# EAGLE design Mainland_revB (EAGLE 9.2.0)
CNAME: plus12BLE; CREVISION: RevB; DESIGNER: Josh DeWitt

## Sheet 1 of 2
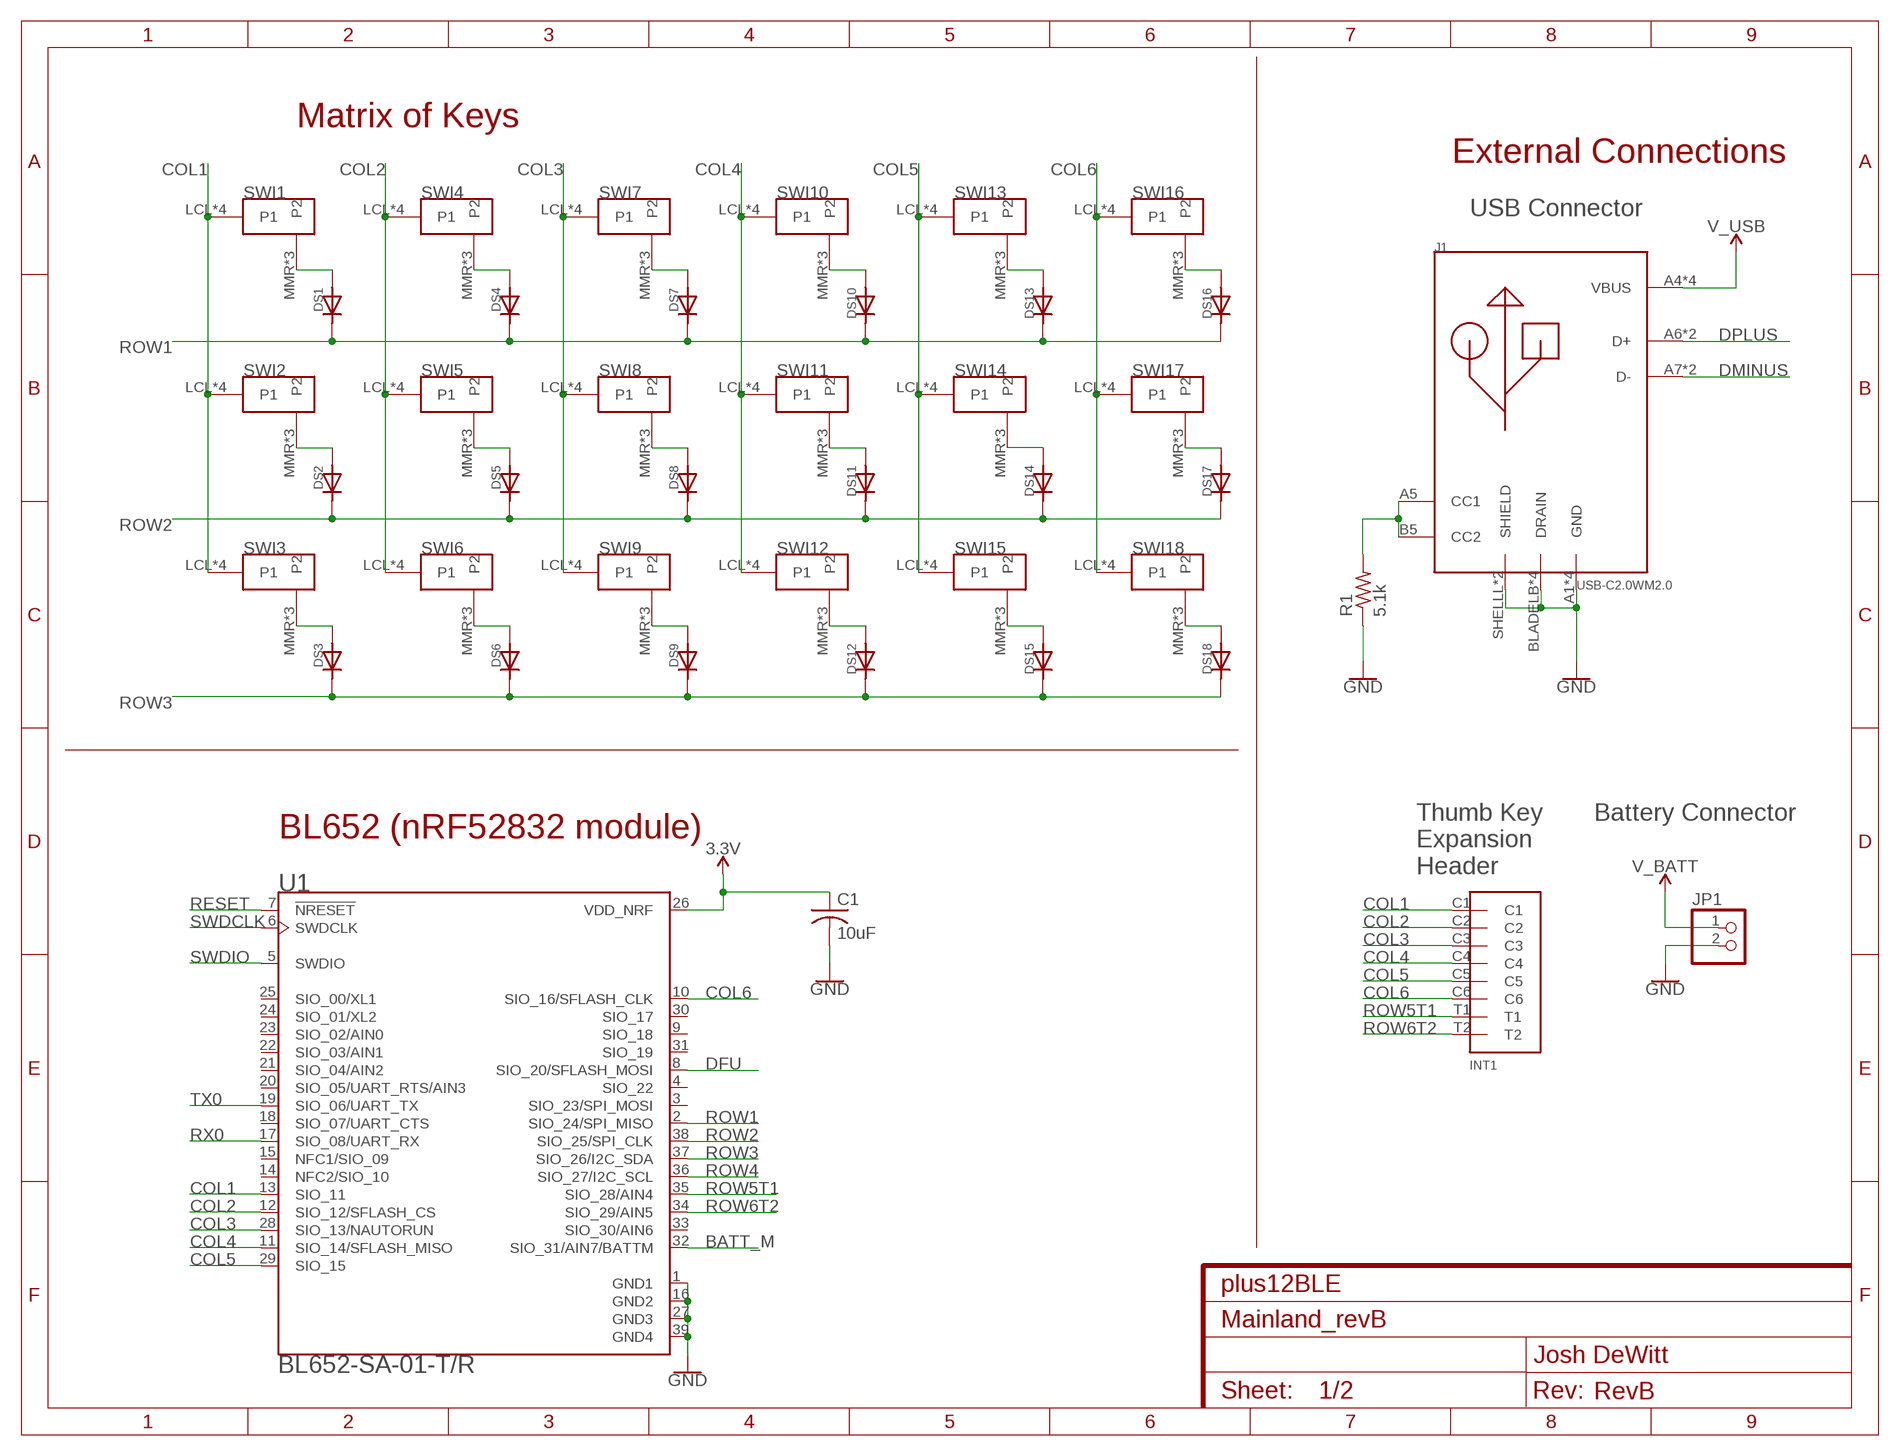
[diagram p0: schematic, sheet 1]

### Parts
C1  10uF  C-USC0805K  [C0805K]
DS1  DIODECOMBO  [DIODE_COMBO]
DS2  DIODECOMBO  [DIODE_COMBO]
DS3  DIODECOMBO  [DIODE_COMBO]
DS4  DIODECOMBO  [DIODE_COMBO]
DS5  DIODECOMBO  [DIODE_COMBO]
DS6  DIODECOMBO  [DIODE_COMBO]
DS7  DIODECOMBO  [DIODE_COMBO]
DS8  DIODECOMBO  [DIODE_COMBO]
DS9  DIODECOMBO  [DIODE_COMBO]
DS10  DIODECOMBO  [DIODE_COMBO]
DS11  DIODECOMBO  [DIODE_COMBO]
DS12  DIODECOMBO  [DIODE_COMBO]
DS13  DIODECOMBO  [DIODE_COMBO]
DS14  DIODECOMBO  [DIODE_COMBO]
DS15  DIODECOMBO  [DIODE_COMBO]
DS16  DIODECOMBO  [DIODE_COMBO]
DS17  DIODECOMBO  [DIODE_COMBO]
DS18  DIODECOMBO  [DIODE_COMBO]
FRAME1  FRAME_LTR_CU_MARK  [FR-LTR-ON-PCB]
INT1  INTRCNNT4X2  [INTRRIBBON]
J1  USB-C2.0WM2.0  [WM17904_SIMP]
JP1  PINHD-1X2  [1X02]
R1  5.1k  R-US_R0603  [R0603]
SWI1  MX/ALPSDOUBLE_SLOT  [DOUBLED_SLOTS]
SWI2  MX/ALPSDOUBLE_SLOT  [DOUBLED_SLOTS]
SWI3  MX/ALPSDOUBLE_SLOT  [DOUBLED_SLOTS]
SWI4  MX/ALPSDOUBLE_SLOT  [DOUBLED_SLOTS]
SWI5  MX/ALPSDOUBLE_SLOT  [DOUBLED_SLOTS]
SWI6  MX/ALPSDOUBLE_SLOT  [DOUBLED_SLOTS]
SWI7  MX/ALPSDOUBLE_SLOT  [DOUBLED_SLOTS]
SWI8  MX/ALPSDOUBLE_SLOT  [DOUBLED_SLOTS]
SWI9  MX/ALPSDOUBLE_SLOT  [DOUBLED_SLOTS]
SWI10  MX/ALPSDOUBLE_SLOT  [DOUBLED_SLOTS]
SWI11  MX/ALPSDOUBLE_SLOT  [DOUBLED_SLOTS]
SWI12  MX/ALPSDOUBLE_SLOT  [DOUBLED_SLOTS]
SWI13  MX/ALPSDOUBLE_SLOT  [DOUBLED_SLOTS]
SWI14  MX/ALPSDOUBLE_SLOT  [DOUBLED_SLOTS]
SWI15  MX/ALPSDOUBLE_SLOT  [DOUBLED_SLOTS]
SWI16  MX/ALPSDOUBLE_SLOT  [DOUBLED_SLOTS]
SWI17  MX/ALPSDOUBLE_SLOT  [DOUBLED_SLOTS]
SWI18  MX/ALPSDOUBLE_SLOT  [DOUBLED_SLOTS]
U1  BL652-SA-01-T/R  [XCVR_BL652-SA-01-T/R]

### Nets
3.3V: C1.1 U1.26(VDD_NRF) ; also sheet 2
BATT_M: U1.32(SIO_31/AIN7/BATTM) ; also sheet 2
COL1: INT1.C1 SWI1.LCL(P1) SWI1.LLP(P1) SWI1.LRLP(P1) SWI1.MML(P1) SWI2.LCL(P1) SWI2.LLP(P1) SWI2.LRLP(P1) SWI2.MML(P1) SWI3.LCL(P1) SWI3.LLP(P1) SWI3.LRLP(P1) SWI3.MML(P1) U1.13(SIO_11)
COL2: INT1.C2 SWI4.LCL(P1) SWI4.LLP(P1) SWI4.LRLP(P1) SWI4.MML(P1) SWI5.LCL(P1) SWI5.LLP(P1) SWI5.LRLP(P1) SWI5.MML(P1) SWI6.LCL(P1) SWI6.LLP(P1) SWI6.LRLP(P1) SWI6.MML(P1) U1.12(SIO_12/SFLASH_CS)
COL3: INT1.C3 SWI7.LCL(P1) SWI7.LLP(P1) SWI7.LRLP(P1) SWI7.MML(P1) SWI8.LCL(P1) SWI8.LLP(P1) SWI8.LRLP(P1) SWI8.MML(P1) SWI9.LCL(P1) SWI9.LLP(P1) SWI9.LRLP(P1) SWI9.MML(P1) U1.28(SIO_13/NAUTORUN)
COL4: INT1.C4 SWI10.LCL(P1) SWI10.LLP(P1) SWI10.LRLP(P1) SWI10.MML(P1) SWI11.LCL(P1) SWI11.LLP(P1) SWI11.LRLP(P1) SWI11.MML(P1) SWI12.LCL(P1) SWI12.LLP(P1) SWI12.LRLP(P1) SWI12.MML(P1) U1.11(SIO_14/SFLASH_MISO)
COL5: INT1.C5 SWI13.LCL(P1) SWI13.LLP(P1) SWI13.LRLP(P1) SWI13.MML(P1) SWI14.LCL(P1) SWI14.LLP(P1) SWI14.LRLP(P1) SWI14.MML(P1) SWI15.LCL(P1) SWI15.LLP(P1) SWI15.LRLP(P1) SWI15.MML(P1) U1.29(SIO_15)
COL6: INT1.C6 SWI16.LCL(P1) SWI16.LLP(P1) SWI16.LRLP(P1) SWI16.MML(P1) SWI17.LCL(P1) SWI17.LLP(P1) SWI17.LRLP(P1) SWI17.MML(P1) SWI18.LCL(P1) SWI18.LLP(P1) SWI18.LRLP(P1) SWI18.MML(P1) U1.10(SIO_16/SFLASH_CLK)
DFU: U1.8(SIO_20/SFLASH_MOSI) ; also sheet 2
DMINUS: J1.A7(D-) J1.B7(D-) ; also sheet 2
DPLUS: J1.A6(D+) J1.B6(D+) ; also sheet 2
GND: C1.2 J1.A1(GND) J1.A12(GND) J1.B1(GND) J1.B12(GND) J1.BLADELB(DRAIN) J1.BLADELF(DRAIN) J1.BLADERB(DRAIN) J1.BLADERF(DRAIN) J1.SHELLL(SHIELD) J1.SHELLR(SHIELD) JP1.2 R1.1 U1.1(GND1) U1.16(GND2) U1.27(GND3) U1.39(GND4) ; also sheet 2
N$1: DS1.ANOST(AN) DS1.ANOT(AN) SWI1.MMR(P2) SWI1.RCL(P2) SWI1.RLMID(P2)
N$2: DS4.ANOST(AN) DS4.ANOT(AN) SWI4.MMR(P2) SWI4.RCL(P2) SWI4.RLMID(P2)
N$3: DS7.ANOST(AN) DS7.ANOT(AN) SWI7.MMR(P2) SWI7.RCL(P2) SWI7.RLMID(P2)
N$4: DS10.ANOST(AN) DS10.ANOT(AN) SWI10.MMR(P2) SWI10.RCL(P2) SWI10.RLMID(P2)
N$5: DS13.ANOST(AN) DS13.ANOT(AN) SWI13.MMR(P2) SWI13.RCL(P2) SWI13.RLMID(P2)
N$6: DS16.ANOST(AN) DS16.ANOT(AN) SWI16.MMR(P2) SWI16.RCL(P2) SWI16.RLMID(P2)
N$7: DS2.ANOST(AN) DS2.ANOT(AN) SWI2.MMR(P2) SWI2.RCL(P2) SWI2.RLMID(P2)
N$8: DS5.ANOST(AN) DS5.ANOT(AN) SWI5.MMR(P2) SWI5.RCL(P2) SWI5.RLMID(P2)
N$9: DS8.ANOST(AN) DS8.ANOT(AN) SWI8.MMR(P2) SWI8.RCL(P2) SWI8.RLMID(P2)
N$10: DS11.ANOST(AN) DS11.ANOT(AN) SWI11.MMR(P2) SWI11.RCL(P2) SWI11.RLMID(P2)
N$11: DS14.ANOST(AN) DS14.ANOT(AN) SWI14.MMR(P2) SWI14.RCL(P2) SWI14.RLMID(P2)
N$12: DS17.ANOST(AN) DS17.ANOT(AN) SWI17.MMR(P2) SWI17.RCL(P2) SWI17.RLMID(P2)
N$13: DS3.ANOST(AN) DS3.ANOT(AN) SWI3.MMR(P2) SWI3.RCL(P2) SWI3.RLMID(P2)
N$14: DS6.ANOST(AN) DS6.ANOT(AN) SWI6.MMR(P2) SWI6.RCL(P2) SWI6.RLMID(P2)
N$15: DS9.ANOST(AN) DS9.ANOT(AN) SWI9.MMR(P2) SWI9.RCL(P2) SWI9.RLMID(P2)
N$16: DS12.ANOST(AN) DS12.ANOT(AN) SWI12.MMR(P2) SWI12.RCL(P2) SWI12.RLMID(P2)
N$17: DS15.ANOST(AN) DS15.ANOT(AN) SWI15.MMR(P2) SWI15.RCL(P2) SWI15.RLMID(P2)
N$18: DS18.ANOST(AN) DS18.ANOT(AN) SWI18.MMR(P2) SWI18.RCL(P2) SWI18.RLMID(P2)
N$20: J1.A5(CC1) J1.B5(CC2) R1.2
RESET: U1.7(!NRESET) ; also sheet 2
ROW1: DS1.CATST(CAT) DS1.CATT(CAT) DS4.CATST(CAT) DS4.CATT(CAT) DS7.CATST(CAT) DS7.CATT(CAT) DS10.CATST(CAT) DS10.CATT(CAT) DS13.CATST(CAT) DS13.CATT(CAT) DS16.CATST(CAT) DS16.CATT(CAT) U1.2(SIO_24/SPI_MISO)
ROW2: DS2.CATST(CAT) DS2.CATT(CAT) DS5.CATST(CAT) DS5.CATT(CAT) DS8.CATST(CAT) DS8.CATT(CAT) DS11.CATST(CAT) DS11.CATT(CAT) DS14.CATST(CAT) DS14.CATT(CAT) DS17.CATST(CAT) DS17.CATT(CAT) U1.38(SIO_25/SPI_CLK)
ROW3: DS3.CATST(CAT) DS3.CATT(CAT) DS6.CATST(CAT) DS6.CATT(CAT) DS9.CATST(CAT) DS9.CATT(CAT) DS12.CATST(CAT) DS12.CATT(CAT) DS15.CATST(CAT) DS15.CATT(CAT) DS18.CATST(CAT) DS18.CATT(CAT) U1.37(SIO_26/I2C_SDA)
ROW4: U1.36(SIO_27/I2C_SCL)
ROW5T1: INT1.T1 U1.35(SIO_28/AIN4)
ROW6T2: INT1.T2 U1.34(SIO_29/AIN5)
RX0: U1.17(SIO_08/UART_RX) ; also sheet 2
SWDCLK: U1.6(SWDCLK) ; also sheet 2
SWDIO: U1.5(SWDIO) ; also sheet 2
TX0: U1.19(SIO_06/UART_TX) ; also sheet 2
V_BATT: JP1.1 ; also sheet 2
V_USB: J1.A4(VBUS) J1.A9(VBUS) J1.B4(VBUS) J1.B9(VBUS) ; also sheet 2
Unconnected: U1.3(SIO_23/SPI_MOSI) U1.4(SIO_22) U1.9(SIO_18) U1.14(NFC2/SIO_10) U1.15(NFC1/SIO_09) U1.18(SIO_07/UART_CTS) U1.20(SIO_05/UART_RTS/AIN3) U1.21(SIO_04/AIN2) U1.22(SIO_03/AIN1) U1.23(SIO_02/AIN0) U1.24(SIO_01/XL2) U1.25(SIO_00/XL1) U1.30(SIO_17) U1.31(SIO_19) U1.33(SIO_30/AIN6)

### Notes on the sheet
- Matrix of Keys
- External Connections
- USB Connector
- Battery Connector
- BL652 (nRF52832 module)
- Thumb Key
  Expansion
  Header

## Sheet 2 of 2
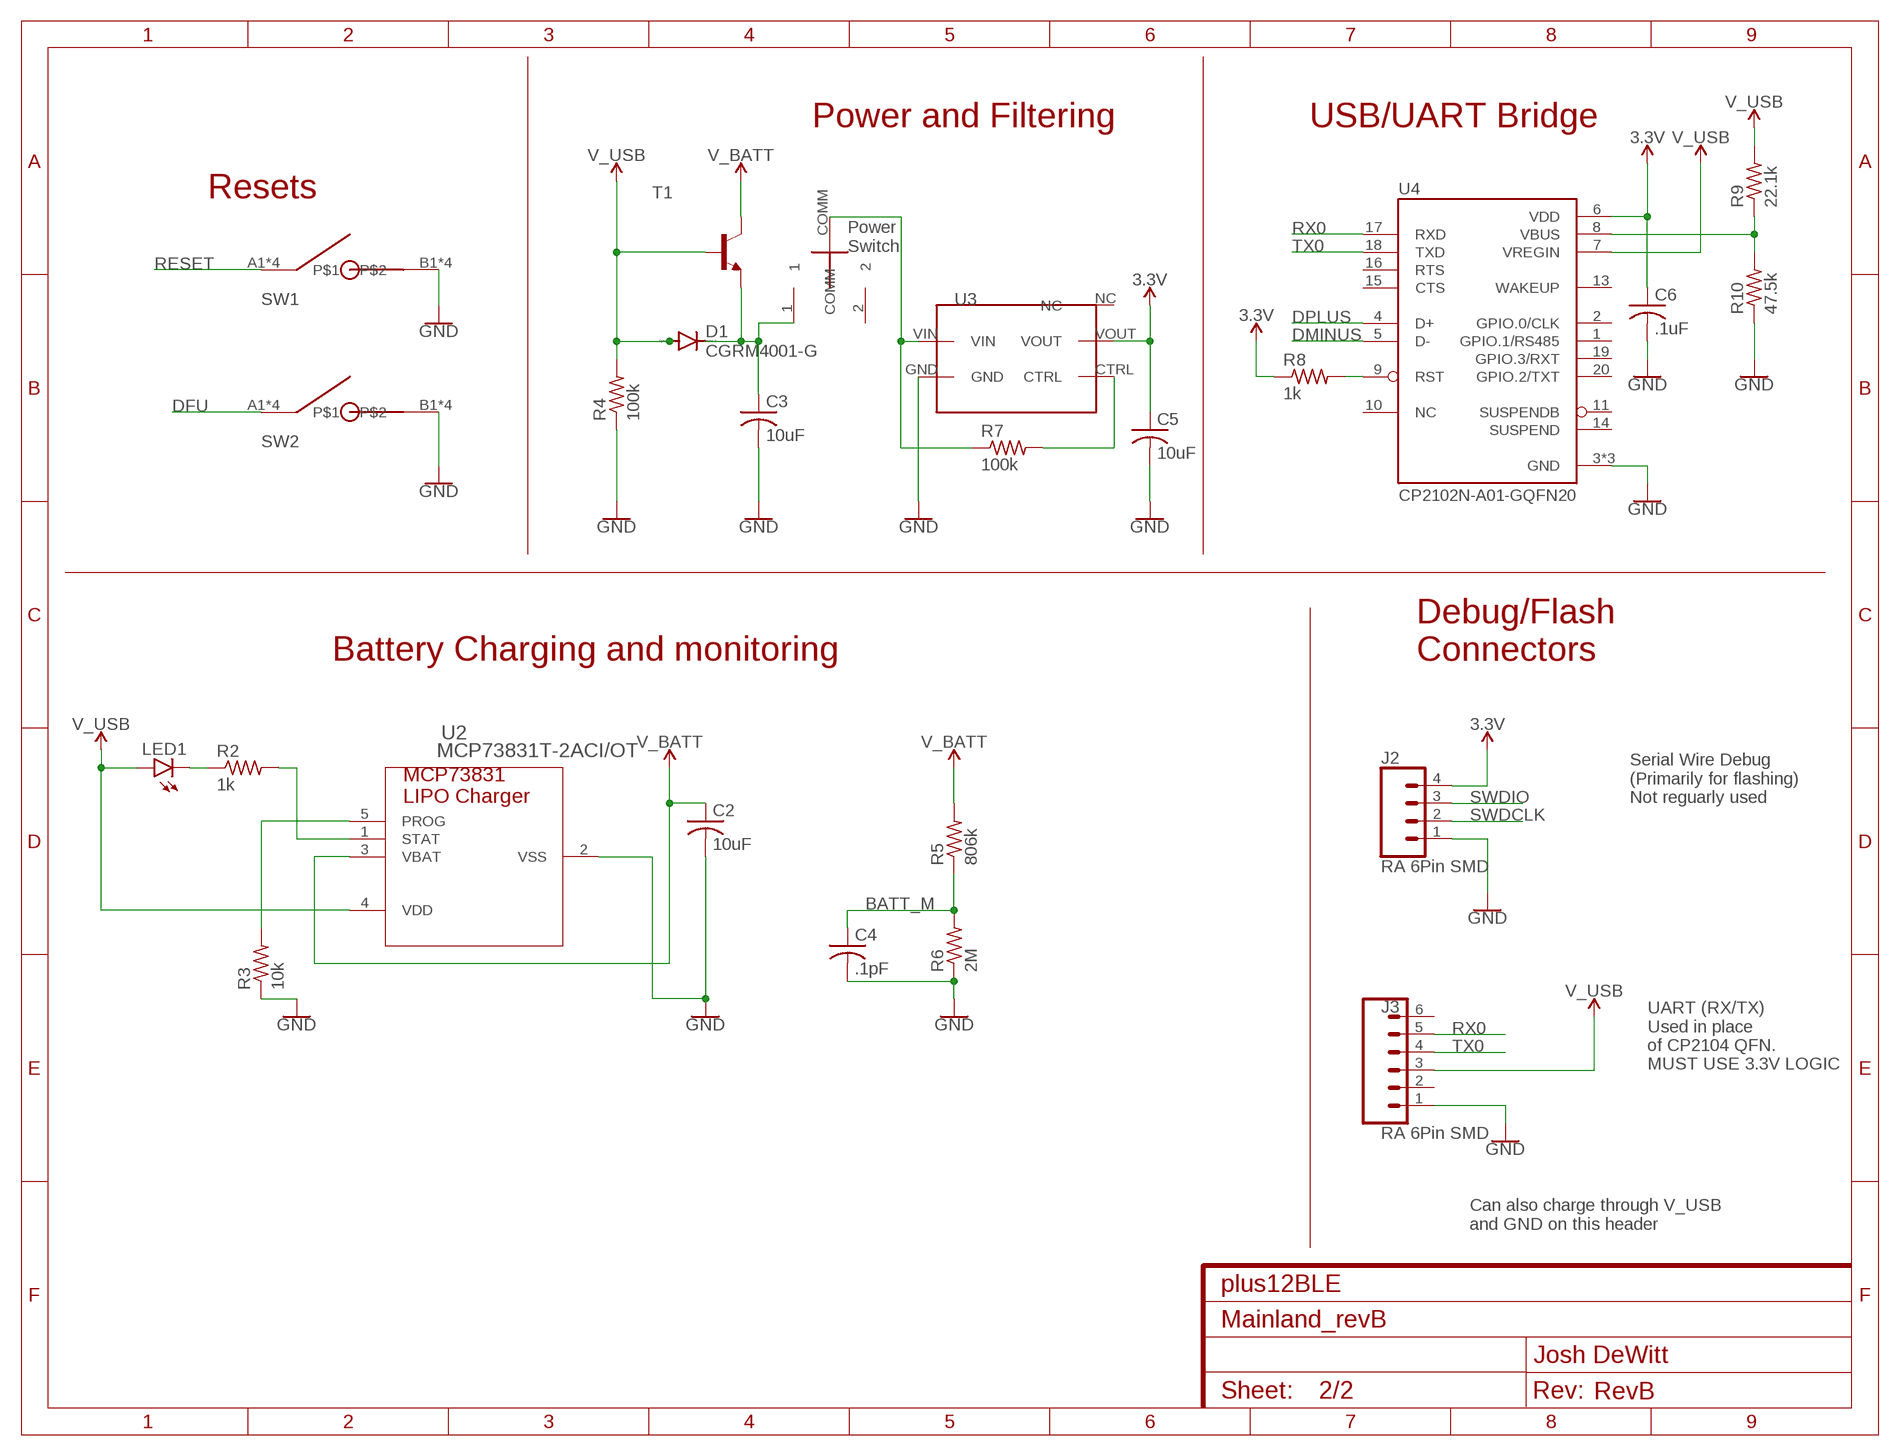
[diagram p1: schematic, sheet 2]

### Parts
C2  10uF  C-USC0805K  [C0805K]
C3  10uF  C-USC0805K  [C0805K]
C4  .1pF  C-USC0603  [C0603]
C5  10uF  C-USC0805K  [C0805K]
C6  .1uF  C-USC0603  [C0603]
D1  CGRM4001-G  [SOD-123_MINI-SMA]
FRAME2  FRAME_LTR_CU_MARK  [FR-LTR-ON-PCB]
J2  RA 6Pin SMD  CONN_04SMD_RA_FEMALE  [1X04_SMD_RA_FEMALE]
J3  RA 6Pin SMD  CONN_06SMD  [1X06-SMD_RA_MALE]
LED1  LEDCHIP-LED0603  [CHIP-LED0603]
R2  1k  R-US_R0603  [R0603]
R3  10k  R-US_R0603  [R0603]
R4  100k  R-US_R0603  [R0603]
R5  806k  R-US_R0603  [R0603]
R6  2M  R-US_R0603  [R0603]
R7  100k  R-US_R0603  [R0603]
R8  1k  R-US_R0603  [R0603]
R9  22.1k  R-US_R0603  [R0603]
R10  47.5k  R-US_R0603  [R0603]
SW1  RSTSWSMALL_SMD  [EVP-BBA]
SW2  RSTSWSMALL_SMD  [EVP-BBA]
SW3  SLIDER_SWITCH  [MHSS1105]
T1  BC808-NPN-SOT23-BEC  [SOT23-BEC]
U2  MCP73831T-2ACI/OT  [SOT-23-5_MC]
U3  TCR2EF  [TCR2EF]
U4  CP2102N-A01-GQFN20  [SILABS_QFN20]

### Nets
3.3V: C5.1 C6.1 J2.4 R8.1 U3.VOUT U4.6(VDD) ; also sheet 1
BATT_M: C4.1 R5.1 R6.2 ; also sheet 1
DFU: SW2.A1 SW2.A2 SW2.A3 SW2.A4 ; also sheet 1
DMINUS: U4.5(D-) ; also sheet 1
DPLUS: U4.4(D+) ; also sheet 1
GND: C2.2 C3.2 C4.2 C5.2 C6.2 J2.1 J3.1 R3.1 R4.1 R6.1 R10.1 SW1.B1 SW1.B2 SW1.B3 SW1.B4 SW2.B1 SW2.B2 SW2.B3 SW2.B4 U2.2(VSS) U3.GND U4.3(GND) U4.12(GND) U4.21(GND) ; also sheet 1
N$19: R7.2 U3.CTRL
N$21: R7.1 SW3.COMM U3.VIN
N$22: LED1.C R2.1
N$23: R2.2 U2.1(STAT)
N$24: R3.2 U2.5(PROG)
N$25: R9.1 R10.2 U4.8(VBUS)
N$26: R8.2 U4.9(RST)
N$27: C3.1 D1.C SW3.1 T1.E
RESET: SW1.A1 SW1.A2 SW1.A3 SW1.A4 ; also sheet 1
RX0: J3.5 U4.17(RXD) ; also sheet 1
SWDCLK: J2.2 ; also sheet 1
SWDIO: J2.3 ; also sheet 1
TX0: J3.4 U4.18(TXD) ; also sheet 1
V_BATT: C2.1 R5.2 T1.C U2.3(VBAT) ; also sheet 1
V_USB: D1.A J3.3 LED1.A R4.2 R9.2 T1.B U2.4(VDD) U4.7(VREGIN) ; also sheet 1
Unconnected: J3.2 J3.6 SW3.2 U3.NC U4.1(GPIO.1/RS485) U4.2(GPIO.0/CLK) U4.10(NC) U4.11(SUSPENDB) U4.13(WAKEUP) U4.14(SUSPEND) U4.15(CTS) U4.16(RTS) U4.19(GPIO.3/RXT) U4.20(GPIO.2/TXT)

### Notes on the sheet
- Power and Filtering | USB/UART Bridge
- Resets
- Power
  Switch
- Battery Charging and monitoring
- Debug/Flash
  Connectors
- Serial Wire Debug
  (Primarily for flashing)
  Not reguarly used
- UART (RX/TX)
  Used in place
  of CP2104 QFN.
  MUST USE 3.3V LOGIC
- Can also charge through V_USB
  and GND on this header

## Library data of the parts
C1-C6 = resistor:C-US: CAPACITOR, American symbol
D1 = diode:CGRM400*-G: Molded plasitc,JEDEC SOD-123/Mini SMA Source: Comchip CGRM4001-G.pdf
DS1-DS18 = Keys:DIODE
FRAME1 FRAME2 = ProperFrame:FRAME_LTR_CU_MARK: Frame sized for 8.5x11" page with 0.25" margin. Places name, datecode and revision mark in bottom copper layer of PCB.
INT1 = Keys:INTRCNNT
J1 = Keys:USB-C2.0
J2 = SparkFun-Connectors:CONN_04: Multi connection point. Often used as Generic Header-pin footprint for 0.1 inch spaced/style header connections On any of the 0.1 inch spaced packages, you can populate with these: Break Away Headers - Straight <https://www.sparkfun.com/products/116> (PRT-00116) Break Away Male Headers - Right Angle <https://www.sparkfun.com/products/553> (PRT-00553) Female Headers <https://www.sparkfun.com/products/115> (PRT-00115) Break Away Headers - Machine Pin <https://www.sparkfun.com/products/117> (PRT-00117) Break Away Female Headers - Swiss Machine Pin <https://www.sparkfun.com/products/743> (PRT-00743) For SCREWTERMINALS and SPRING TERMINALS visit here: Screw Terimnals on SparkFun.com <https://www.sparkfun.com/search/results?term=Screw+Terminals> (5mm/3.5mm/2.54mm spacing) This device is also useful as a general connection point to wire up your design to another part of your project. Our various solder wires solder well into these plated through hole pads. Hook-Up Wire - Assortment (Stranded, 22 AWG) <https://www.sparkfun.com/products/11375> (PRT-11375) Hook-Up Wire - Assortment (Solid Core, 22 AWG) <https://www.sparkfun.com/products/11367> (PRT-11367) View the entire wire category on our website here <https://www.sparkfun.com/categories/141> Special notes: Molex polarized connector foot print use with SKU : PRT-08231 with associated crimp pins and housings. 1MM SMD Version SKU: PRT-10208; PROD_ID: CONN-12382
J3 = SparkFun-Connectors:CONN_06: Multi connection point. Often used as Generic Header-pin footprint for 0.1 inch spaced/style header connections On any of the 0.1 inch spaced packages, you can populate with these: Break Away Headers - Straight <https://www.sparkfun.com/products/116> (PRT-00116) Break Away Male Headers - Right Angle <https://www.sparkfun.com/products/553> (PRT-00553) Female Headers <https://www.sparkfun.com/products/115> (PRT-00115) Break Away Headers - Machine Pin <https://www.sparkfun.com/products/117> (PRT-00117) Break Away Female Headers - Swiss Machine Pin <https://www.sparkfun.com/products/743> (PRT-00743) Arduino Stackable Header - 6 Pin <https://www.sparkfun.com/products/9280> (PRT-09280) For SCREWTERMINALS and SPRING TERMINALS visit here: Screw Terimnals on SparkFun.com <https://www.sparkfun.com/search/results?term=Screw+Terminals> (5mm/3.5mm/2.54mm spacing) This device is also useful as a general connection point to wire up your design to another part of your project. Our various solder wires solder well into these plated through hole pads. Hook-Up Wire - Assortment (Stranded, 22 AWG) <https://www.sparkfun.com/products/11375> (PRT-11375) Hook-Up Wire - Assortment (Solid Core, 22 AWG) <https://www.sparkfun.com/products/11367> (PRT-11367) View the entire wire category on our website here <https://www.sparkfun.com/categories/141>; PROD_ID: CONN-08971
JP1 = pinhead:PINHD-1X2: PIN HEADER
LED1 = led:LED: LED OSRAM: - CHIPLED LG R971, LG N971, LY N971, LG Q971, LY Q971, LO R971, LY R971 LH N974, LH R974 LS Q976, LO Q976, LY Q976 LO Q996 - Hyper CHIPLED LW Q18S LB Q993, LB Q99A, LB R99A - SideLED LS A670, LO A670, LY A670, LG A670, LP A670 LB A673, LV A673, LT A673, LW A673 LH A674 LY A675 LS A676, LA A676, LO A676, LY A676, LW A676 LS A679, LY A679, LG A679 - Hyper Micro SIDELED® LS Y876, LA Y876, LO Y876, LY Y876 LT Y87S - SmartLED LW L88C, LW L88S LB L89C, LB L89S, LG L890 LS L89K, LO L89K, LY L89K LS L896, LA L896, LO L896, LY L896 - TOPLED LS T670, LO T670, LY T670, LG T670, LP T670 LSG T670, LSP T670, LSY T670, LOP T670, LYG T670 LG T671, LOG T671, LSG T671 LB T673, LV T673, LT T673, LW T673 LH T674 LS T676, LA T676, LO T676, LY T676, LB T676, LH T676, LSB T676, LW T676 LB T67C, LV T67C, LT T67C, LS T67K, LO T67K, LY T67K, LW E67C LS E67B, LA E67B, LO E67B, LY E67B, LB E67C, LV E67C, LT E67C LW T67C LS T679, LY T679, LG T679 LS T770, LO T770, LY T770, LG T770, LP T770 LB T773, LV T773, LT T773, LW T773 LH T774 LS E675, LA E675, LY E675, LS T675 LS T776, LA T776, LO T776, LY T776, LB T776 LHGB T686 LT T68C, LB T68C - Hyper Mini TOPLED® LB M676 - Mini TOPLED Santana® LG M470 LS M47K, LO M47K, LY M47K Source: http://www.osram.convergy.de LUXEON: - LUMILED® LXK2-PW12-R00, LXK2-PW12-S00, LXK2-PW14-U00, LXK2-PW14-V00 LXK2-PM12-R00, LXK2-PM12-S00, LXK2-PM14-U00 LXK2-PE12-Q00, LXK2-PE12-R00, LXK2-PE12-S00, LXK2-PE14-T00, LXK2-PE14-U00 LXK2-PB12-K00, LXK2-PB12-L00, LXK2-PB12-M00, LXK2-PB14-N00, LXK2-PB14-P00, LXK2-PB14-Q00 LXK2-PR12-L00, LXK2-PR12-M00, LXK2-PR14-Q00, LXK2-PR14-R00 LXK2-PD12-Q00, LXK2-PD12-R00, LXK2-PD12-S00 LXK2-PH12-R00, LXK2-PH12-S00 LXK2-PL12-P00, LXK2-PL12-Q00, LXK2-PL12-R00 Source: www.luxeon.com KINGBRIGHT: KA-3528ASYC Source: www.kingbright.com
R1-R10 = resistor:R-US_: RESISTOR, American symbol
SW1 SW2 = Keys:RSTSW
SW3 = Keys:SLIDER_SWITCH
SWI1-SWI18 = Keys:MX/ALPS
T1 = transistor:*-NPN-: NPN Transistror BF959 corrected 2008.03.06
U1 = BL652-SA-01-T_R:BL652-SA-01-T/R: Bluetooth v4.2 Module with NFC (Integrated Antenna); DESCRIPTION: Bluetooth 1.8V to 3.6V 1Mbps 39-Pin SMD Module T/R; DIGI-KEY_PART_NUMBER: BL652-SA-01-CT-ND; DIGI-KEY_PURCHASE_URL: https://www.digikey.com/product-detail/en/laird-wireless-thermal-systems/BL652-SA-01-T-R/BL652-SA-01-CT-ND/6181738?utm_source=snapeda&utm_medium=aggregator&utm_campaign=symbol; MF: Laird -; MP: BL652-SA-01-T/R; PACKAGE: SMD-39 Laird
U2 = MCP73831:MCP73831T-2ACI/OT; MANUFACTURER_PART_NUMBER: MCP73831T2ACIOT; VENDOR: Microchip
U3 = Keys:TCR2EF
U4 = CP2102N-A01-GQFN20:CP2102N-A01-GQFN20: Ic Bridge Usb To Uart 20qfn; DESCRIPTION: Usb-Uart Interface Bridge, Qfn-20; DIGI-KEY_PART_NUMBER: 336-3692-ND; DIGI-KEY_PURCHASE_URL: https://www.digikey.com/product-detail/en/silicon-labs/CP2102N-A01-GQFN20/336-3692-ND/6012517?utm_source=snapeda&utm_medium=aggregator&utm_campaign=symbol; MF: Silicon Labs; MP: CP2102N-A01-GQFN20; PACKAGE: QFN-20 Silicon Labs

## Net classes
1 Power: width 0.254 mm

## Board
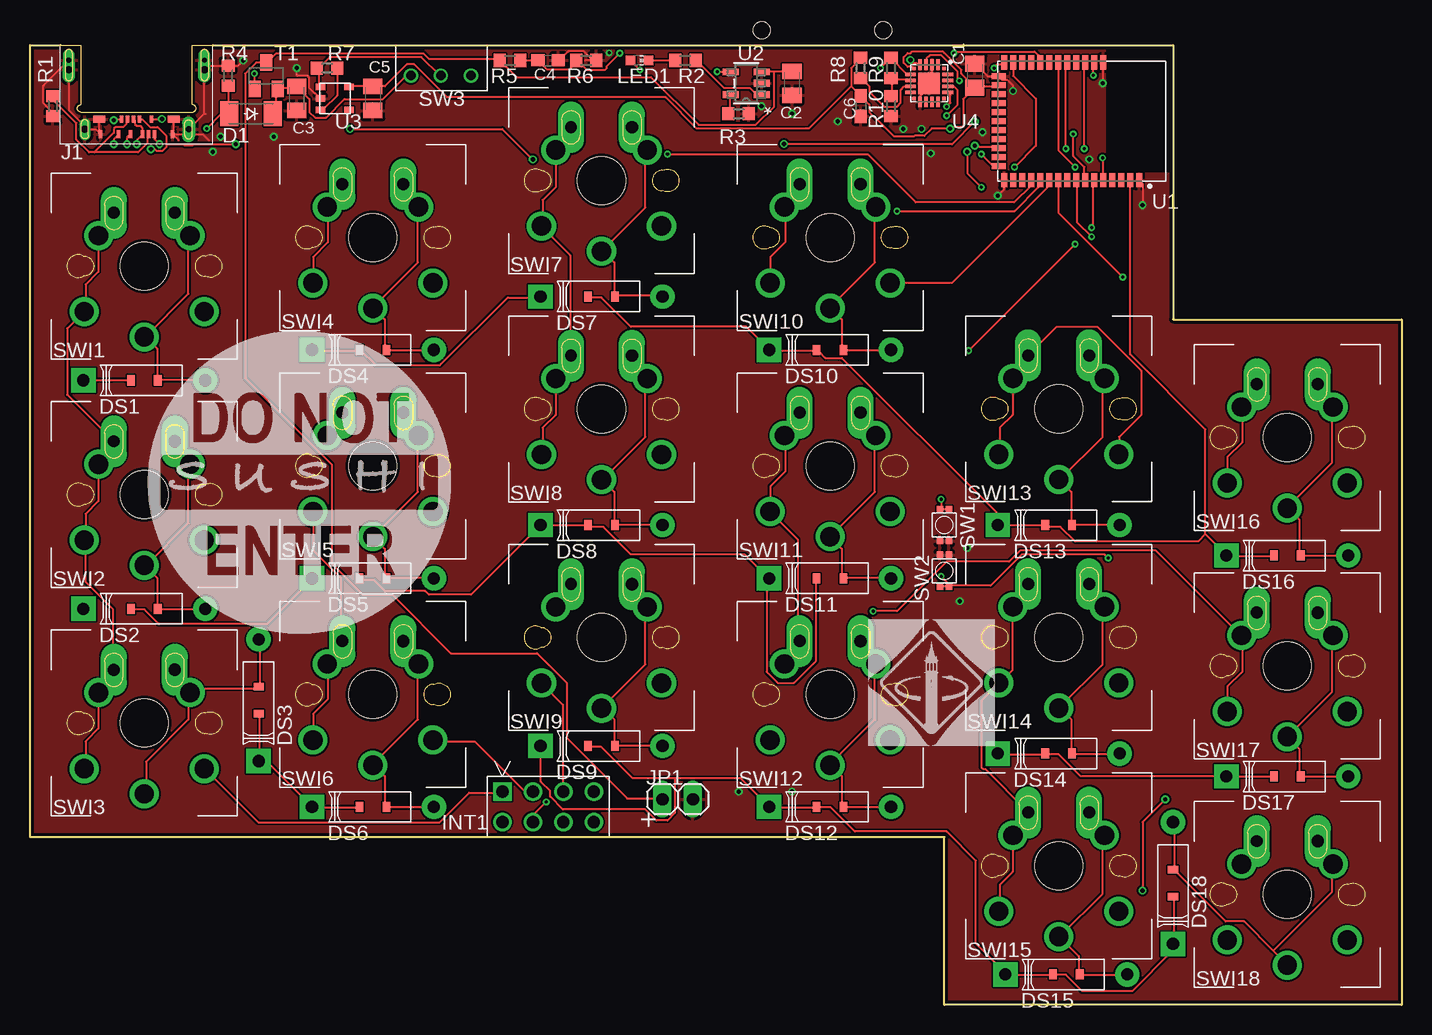
[diagram p2: board, top side]
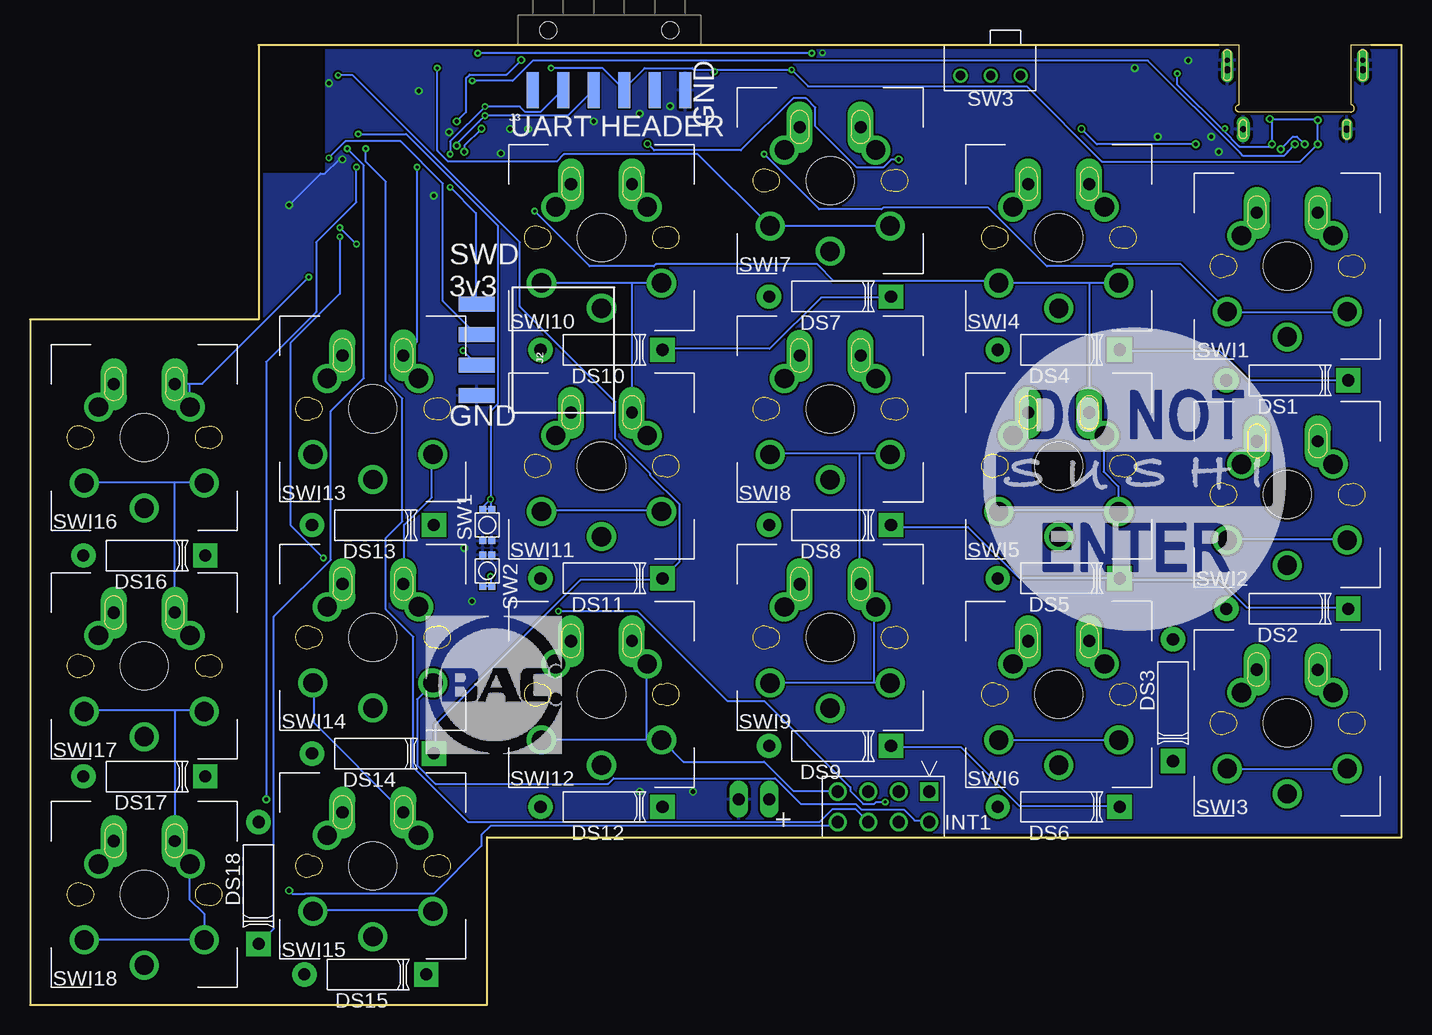
[diagram p3: board, bottom side, seen from below]

Size 114.3 x 80.01 mm. Coordinates in mm from the lower left corner, seen from the top.
Outline: 2.54,80.01 0,80.01 0,13.97 76.2,13.97 76.2,0 114.3,0 114.3,57.15 95.25,57.15 95.25,80.01 15.24,80.01
Copper layers (1*16): Top 0.035mm / dielectric 1.5mm / Bottom 0.035mm
Design rules "Sierra *": minimum track width 0.153mm, minimum drill 10mil, track to track 0.153mm, track to pad 0.153mm, pad to pad 0.153mm, via to via 0.153mm, smd to smd 0.153mm, copper to edge 10mil, drill to drill 10mil, minimum pad ring 6mil, minimum via ring 6mil, stop-mask expansion 4mil, vias tented up to drill 0mil, thermal gap 10mil
tKeepout: area 90.2,69.8 to 95.9,80.6
bKeepout: area 90.2,69.8 to 95.9,80.6
tRestrict: area 89.8,69.5 to 95.9,80.6
bRestrict: area 89.8,69.5 to 95.9,80.6

### Footprints (pad centres in the part's own frame; a part is rotated, then mirrored left to right if it is on the bottom)
C0805K = smd 1.3 x 1.6: 1 -1,0; 2 1,0
C0603 = smd 1.1 x 1: 1 -0.85,0; 2 0.85,0
SOD-123_MINI-SMA = smd 1.5 x 2.1: A 1.8,0; C -1.8,0
DIODE_COMBO = smd 0.635 x 0.838: ANOST 1.118,0; CATST -1.118,0 | drill 1.016 pad 2.032: ANOT 5.08,0 | drill 1.016 pad 2.032 square: CATT -5.08,0
INTRRIBBON = drill 1.016 square: C1 0,0 | drill 1.016: C2 2.54,0; C3 5.08,0; C4 7.62,0; C5 0,-2.54; C6 2.54,-2.54; T1 5.08,-2.54; T2 7.62,-2.54
WM17904_SIMP = smd 0.3 x 0.7: A1 -3,7.42; A4 -1.5,7.42; A5 -1,7.42; A6 -0.5,7.42; A7 0.5,7.42; A9 1.5,7.42; A12 3,7.42 | smd 1 x 0.6: B1 3.1,6.17; B12 -3.1,6.17 | smd 0.3 x 0.6: B4 1.25,6.17; B5 0.75,6.17; B6 0.25,6.17; B7 -0.25,6.17; B9 -1.25,6.17 | drill 0.6 pad 1.05 long: BLADELB -5.65,2.05; BLADERB 5.65,2.05 | drill 0.4 pad 0.95 long: BLADELF -5.65,1.25; BLADERF 5.65,1.25 | drill 0.5 pad 1.1 long: SHELLL -4.32,7.01 | drill 0.6 long: SHELLR 4.32,7.01
1X04_SMD_RA_FEMALE = smd 1.25 x 3: 1 -3.81,7.225; 2 -1.27,7.225; 3 1.27,7.225; 4 3.81,7.225
1X06-SMD_RA_MALE = smd 1 x 3: 1 -6.35,5; 2 -3.81,5; 3 -1.27,5; 4 1.27,5; 5 3.81,5; 6 6.35,5 | hole 1.4: -5.08,0; 5.08,0
1X02 = drill 1.016 long: 1 -1.27,0; 2 1.27,0
CHIP-LED0603 = smd 0.8 x 0.8: A 0,-0.75; C 0,0.75
R0603 = smd 1 x 1.1: 1 -0.85,0; 2 0.85,0
EVP-BBA = smd 0.55 x 0.55 bottom: A1 -1.325,0.375; A4 -1.325,-0.375; B3 1.325,0.375; B4 1.325,-0.375 | smd 0.55 x 0.55: A2 -1.325,-0.375; A3 -1.325,0.375; B1 1.325,0.375; B2 1.325,-0.375
MHSS1105 = drill 0.787: 1 0,0; 2 5.004,0; COMM 2.489,0
DOUBLED_SLOTS = drill 1.613: LCL -3.81,2.54; LLP -5,-3.8; LRLP 5,-3.8; RCL 3.81,2.54; RLMID 0,-5.9 | drill 0.991 pad 2.159 long: MML -2.54,4.445 | drill 1.016 pad 2.159 long: MMR 2.54,4.445 | hole 3.988: 0,0
SOT23-BEC = smd 1 x 1.4: B -0.95,-1.1; C 0,1.1; E 0.95,-1.1
XCVR_BL652-SA-01-T/R = smd 1.2 x 0.5: 1 4.9,4.8; 2 4.9,4.05; 3 4.9,3.3; 4 4.9,2.55; 5 4.9,1.8; 6 4.9,1.05; 7 4.9,0.3; 8 4.9,-0.45; 9 4.9,-1.2; 10 4.9,-1.95; 11 4.9,-2.7; 12 4.9,-3.45; 13 4.9,-4.2; 14 4.9,-4.95; 15 4.9,-5.7; 16 4.9,-6.45; 28 -4.9,-6.45; 29 -4.9,-5.7; 30 -4.9,-4.95; 31 -4.9,-4.2; 32 -4.9,-3.45; 33 -4.9,-2.7; 34 -4.9,-1.95; 35 -4.9,-1.2; 36 -4.9,-0.45; 37 -4.9,0.3; 38 -4.9,1.05; 39 -4.9,1.8 | smd 0.5 x 1.2: 17 3.75,-6.9; 18 3,-6.9; 19 2.25,-6.9; 20 1.5,-6.9; 21 0.75,-6.9; 22 0,-6.9; 23 -0.75,-6.9; 24 -1.5,-6.9; 25 -2.25,-6.9; 26 -3,-6.9; 27 -3.75,-6.9
SOT-23-5_MC = smd 1.321 x 0.559: 1 -1.295,0.95; 2 -1.295,0; 3 -1.295,-0.95; 4 1.295,-0.95; 5 1.295,0.95
TCR2EF = smd 0.8 x 0.55: CTRL -1.2,-0.95; GND -1.2,0; NC 1.2,-0.95; VIN -1.2,0.95; VOUT 1.2,0.95
SILABS_QFN20 = smd 0.3 x 0.3: 1 -1.25,1.25; 6 -1.25,-1.25; 11 1.25,-1.25; 16 1.25,1.25 | smd 0.9 x 0.3: 2 -1.55,0.75; 3 -1.55,0.25; 4 -1.55,-0.25; 5 -1.55,-0.75; 12 1.55,-0.75; 13 1.55,-0.25; 14 1.55,0.25; 15 1.55,0.75 | smd 0.3 x 0.9: 7 -0.75,-1.55; 8 -0.25,-1.55; 9 0.25,-1.55; 10 0.75,-1.55; 17 0.75,1.55; 18 0.25,1.55; 19 -0.25,1.55; 20 -0.75,1.55 | smd 1.8 x 1.8: 21 0,0

### Placement (x,y rotation side)
C1  78.74,77.47 90 top
C2  63.5,76.84 270 top
C3  22.23,75.56 270 top
C4  43.18,78.74 0 top
C5  28.57,75.56 270 top
C6  69.22,74.93 270 top
D1  18.41,74.29 180 top
DS1  9.52,52.07 0 top
DS2  9.52,33.02 0 top
DS3  19.05,25.4 90 top
DS4  28.57,54.61 0 top
DS5  28.57,35.56 0 top
DS6  28.57,16.51 0 top
DS7  47.63,59.05 0 top
DS8  47.63,40.01 0 top
DS9  47.63,21.59 0 top
DS10  66.68,54.61 0 top
DS11  66.68,35.56 0 top
DS12  66.68,16.51 0 top
DS13  85.72,40.01 0 top
DS14  85.72,20.95 0 top
DS15  86.36,2.54 0 top
DS16  104.78,37.46 0 top
DS17  104.78,19.05 0 top
DS18  95.25,10.16 90 top
FRAME1  8.89,84.45 0 top  (outside the outline)
FRAME2  4.7,21.97 90 top
INT1  39.37,17.78 0 top
J1  8.89,80.01 180 top
J2  69.85,54.61 90 bottom
J3  66.04,81.28 180 bottom
JP1  53.98,17.14 0 top
LED1  50.8,78.74 270 top
R1  1.91,74.93 90 top
R2  54.61,78.74 0 top
R3  59.05,74.29 180 top
R4  16.51,77.47 270 top
R5  40.01,78.74 180 top
R6  46.35,78.74 180 top
R7  24.77,78.1 0 top
R8  69.22,78.1 270 top
R9  71.75,78.1 90 top
R10  71.75,74.93 90 top
SW1  76.2,40.01 270 top
SW2  76.2,36.2 90 top
SW3  31.75,77.47 0 top
SWI1  9.52,61.59 0 top
SWI2  9.52,42.54 0 top
SWI3  9.52,23.49 0 top
SWI4  28.57,63.98 0 top
SWI5  28.57,44.93 0 top
SWI6  28.57,25.88 0 top
SWI7  47.63,68.73 0 top
SWI8  47.63,49.68 0 top
SWI9  47.63,30.63 0 top
SWI10  66.68,63.98 0 top
SWI11  66.68,44.93 0 top
SWI12  66.68,25.88 0 top
SWI13  85.72,49.7 0 top
SWI14  85.72,30.65 0 top
SWI15  85.72,11.6 0 top
SWI16  104.78,47.31 0 top
SWI17  104.78,28.26 0 top
SWI18  104.78,9.21 0 top
T1  19.69,77.47 0 top
U1  87.63,73.66 270 top
U2  59.69,76.84 180 top
U3  25.4,75.56 0 top
U4  74.93,76.84 270 top
U$1  [1INCH_TOP]  9.78,30.86 0 top
U$2  [BAC_SELLOUT]  81.28,20.95 0 bottom
U$3  [1INCH_TOP]  34.93,31.12 0 bottom
U$4  [IEEE_BERKELEY]  69.85,21.59 0 top

### Tracks (layer width: path | path; a pad name or v marks a point on that pad's centre or on a via)
3.3V  (via drill 0.25, 0.35)
  Top 0.153: 76.19,79.37 77.61,77.96 77.61,77.65 78.68,76.58 C1.1 | U1.26 80.67,76.58 78.83,76.58 C1.1 | C1.1 78.68,76.43 77.76,75.51 77.76,73.22 76.84,73.22 | U3.VOUT 26.66,76.58 28.49,76.58 C5.1 28.65,76.58 29.56,76.58 31.4,78.42 32.01,78.42 34.77,75.66 52.97,75.66 55.57,73.06 64.91,73.06 68.43,76.58 | 68.43,76.58 69.19,75.82 C6.1 69.34,75.66 69.96,75.05 69.96,74.44 71.18,73.22 | 68.43,76.58 68.43,78.11 69.19,78.88 R8.1
  Top 0.178: 76.19,79.37 76.06,79.5 73.54,79.5 73.39,79.35 73.13,79.35 72.8,79.01 72.8,78.54 73.13,78.21 73.39,78.21 73.42,78.17 73.59,78.17 U4.6 | 76.84,73.22 v76.67,73.05 75.13,73.05 74.53,72.46 73.73,72.46 73.66,72.39 72,72.39 71.18,73.22 | v78.1,71.12 78.1,69.35 v79.29,68.17
  Bottom 0.153: v79.29,68.17 77.15,66.02 77.15,58.53 J2.4
  Bottom 0.178: v76.67,73.05 78.1,71.62 v78.1,71.12
BATT_M  (via drill 0.25)
  Top 0.153: R5.1 40.89,78.72 42.26,78.72 C4.1 42.42,78.88 | 45.48,78.88 R6.2 45.63,78.72 45.67,78.69 46.39,77.96 47.92,77.96 48.08,78.11 48.08,78.26 v49.15,79.34 | v76.99,79.34 77.15,79.49 83.73,79.49 84.03,79.18 84.03,78.57 U1.32
  Top 0.178: C4.1 43.07,78 44.98,78 45.67,78.69
  Bottom 0.153: v49.15,79.34 v76.99,79.34
COL1  (via drill 0.25)
  Top 0.153: SWI3.LLP 4.62,19.82 4.62,21.96 5.7,23.03 5.7,25.94 SWI3.LCL 5.85,26.09 6.92,27.16 6.92,27.93 SWI3.MML 6.92,28.08 6.92,32.98 4.62,35.27 4.62,38.64 SWI2.LLP 4.62,38.79 4.62,40.93 5.7,42 5.7,45.06 SWI2.LCL 5.85,45.22 6.92,46.29 6.92,46.9 SWI2.MML 6.92,47.05 3.09,50.88 3.09,56.38 4.47,57.76 SWI1.LLP 4.62,57.91 4.62,60.06 5.7,61.13 5.7,64.03 SWI1.LCL 5.85,64.19 6.92,65.26 6.92,66.02 SWI1.MML | INT1.C1 39.36,17.68 36.6,17.68 34.15,15.23 19.01,15.23 14.57,19.66 SWI3.LRLP | v53.13,70.92 69.8,70.92 73.8,66.92 82.02,66.92 83.42,68.32 83.42,68.62 U1.13
  Bottom 0.153: SWI2.LRLP 14.42,38.79 4.62,38.79 SWI2.LLP | SWI3.LLP 4.62,19.66 14.42,19.66 SWI3.LRLP | v53.13,70.92 48.54,66.33 43.33,66.33 43.18,66.48 34.46,66.48 29.56,61.59 24.21,61.59 24.06,61.74 18.4,61.74 14.57,57.91 SWI1.LRLP 14.42,57.76 4.62,57.76 SWI1.LLP
COL2  (via drill 0.25)
  Top 0.153: SWI6.LLP 23.6,22.11 23.6,24.26 24.82,25.48 24.82,28.39 SWI6.LCL 24.82,28.54 25.89,29.61 25.89,30.22 SWI6.MML 25.89,30.37 25.89,35.58 23.6,37.87 23.6,41.09 SWI5.LLP | INT1.C2 41.8,17.83 41.19,17.83 37.06,21.96 33.7,21.96 SWI6.LRLP | SWI5.MML 25.89,49.35 25.89,48.58 24.82,47.51 SWI5.LCL | SWI4.MML 25.89,68.32 25.89,67.71 24.82,66.64 SWI4.LCL 24.82,66.48 24.82,63.58 23.6,62.35 23.6,60.21 SWI4.LLP | v72.25,66.18 82.04,66.18 84.03,68.17 84.03,68.62 U1.12
  Bottom 0.153: SWI6.LLP 23.6,22.11 33.54,22.11 SWI6.LRLP | 23.6,41.24 23.6,43.23 24.82,44.45 24.82,47.36 SWI5.LCL | 23.6,41.24 33.54,41.24 SWI5.LRLP | 23.6,41.24 SWI5.LLP | v72.25,66.18 67.66,61.59 62.31,61.59 62.15,61.74 48.69,61.74 47.31,60.36 33.85,60.36 33.7,60.21 SWI4.LRLP 33.54,60.21 26.04,60.21 | 26.04,60.21 23.6,60.21 SWI4.LLP | 26.04,60.21 26.04,49.5 SWI5.MML
COL3  (via drill 0.25)
  Top 0.153: SWI8.LLP 42.72,45.98 42.72,48.12 43.79,49.19 43.79,52.1 SWI8.LCL 43.95,52.25 45.02,53.32 45.02,54.09 SWI8.MML 45.02,54.24 45.02,62.51 42.72,64.8 SWI7.LLP 42.72,64.95 42.72,67.09 43.79,68.17 43.79,71.23 SWI7.LCL 43.95,71.38 45.02,72.45 45.02,73.06 SWI7.MML | SWI9.MML 45.02,34.96 45.02,34.35 43.95,33.28 SWI9.LCL | INT1.C3 44.41,17.83 44.41,25.02 42.72,26.7 SWI9.LLP | v80.36,78.11 80.67,78.42 81.12,78.42 U1.28
  Bottom 0.153: 45.17,45.98 42.72,45.98 SWI8.LLP | 45.17,45.98 52.51,45.98 SWI8.LRLP | 43.95,26.86 42.72,26.86 SWI9.LLP | 43.95,26.86 52.51,26.86 SWI9.LRLP | 43.95,26.86 43.95,33.13 SWI9.LCL | 45.17,45.98 45.17,35.12 SWI9.MML | v80.36,78.11 80.36,71.23 79.44,70.31 70.41,70.31 69.8,70.92 58.63,70.92 52.67,64.95 SWI7.LRLP 52.51,64.95 42.72,64.95 SWI7.LLP
COL4
  Top 0.153: SWI12.LCL 62.92,28.54 63.99,29.61 63.99,30.22 SWI12.MML 63.99,30.37 63.99,38.79 61.69,41.09 SWI11.LLP 61.69,41.24 61.69,43.23 62.92,44.45 62.92,47.36 SWI11.LCL 62.92,47.51 63.99,48.58 63.99,49.35 SWI11.MML | SWI10.MML 63.99,68.32 63.99,67.71 62.92,66.64 SWI10.LCL 62.92,66.48 62.92,63.58 61.69,62.35 61.69,60.21 SWI10.LLP | U1.11 84.8,68.62 84.8,68.17 76.84,60.21 71.79,60.21 SWI10.LRLP
  Bottom 0.153: INT1.C4 47.01,17.83 50.68,17.83 53.13,20.28 59.86,20.28 61.54,21.96 SWI12.LLP 61.69,22.11 62.92,22.11 | 62.92,22.11 71.64,22.11 SWI12.LRLP | 62.92,22.11 62.92,28.39 SWI12.LCL | SWI11.LRLP 71.64,41.24 61.69,41.24 SWI11.LLP | 64.14,60.21 71.64,60.21 SWI10.LRLP | 64.14,60.21 61.69,60.21 SWI10.LLP | 64.14,60.21 64.14,49.5 SWI11.MML
COL5  (via drill 0.25)
  Top 0.153: SWI13.LLP 80.82,45.98 80.82,48.12 81.89,49.19 81.89,52.1 SWI13.LCL 82.04,52.25 82.04,53.02 83.11,54.09 SWI13.MML 83.27,54.24 85.56,56.54 88.93,56.54 92.6,52.87 92.6,49.19 90.76,47.36 90.76,45.98 SWI13.LRLP | 82.04,78.42 U1.29 | SWI15.LLP 80.82,7.88 80.82,10.03 81.89,11.1 81.89,14 SWI15.LCL 82.04,14.16 83.11,15.23 83.11,15.99 SWI15.MML 83.11,16.15 79.59,19.66 79.44,19.66 79.29,19.82 79.29,25.33 80.67,26.7 SWI14.LLP 80.82,26.86 81.89,27.93 81.89,33.13 SWI14.LCL 82.04,33.28 83.11,34.35 83.11,34.96 SWI14.MML
  Top 0.178: U1.29 81.93,77.45 83.82,75.56 83.82,71.63 v82.04,69.85
  Bottom 0.153: v82.04,69.85 82.04,55.31 83.11,54.24 SWI13.MML | SWI15.LRLP 90.61,7.88 80.82,7.88 SWI15.LLP | SWI14.LRLP 90.61,26.7 90.61,23.49 83.27,16.15 SWI15.MML | INT1.C5 39.51,15.38 40.58,15.38 41.5,16.3 45.02,16.3 45.48,16.76 50.07,16.76 52.21,18.9 65.67,18.9 66.13,18.44 80.51,18.44 82.04,19.97 82.04,25.48 80.82,26.7 SWI14.LLP | SWI13.LLP 80.82,45.83 80.82,42.31 83.11,40.01 83.11,35.12 SWI14.MML
COL6  (via drill 0.25)
  Top 0.153: SWI16.LLP 99.79,43.53 99.79,45.68 101.01,46.9 101.01,49.81 SWI16.LCL | v91.07,60.67 85.72,66.02 85.72,68.62 U1.10 | SWI18.MML 102.09,13.54 102.09,12.93 101.01,11.86 SWI18.LCL | v43.03,16.91 41.96,15.84 41.96,15.38 INT1.C6 | v70.26,32.82 72.25,32.82 76.38,36.95 81.58,36.95 82.5,37.87 93.82,37.87 100.56,31.14 | 100.56,31.14 100.86,30.83 SWI17.LCL | 100.56,31.14 102.09,32.67 SWI17.MML | 100.56,31.14 SWI17.LCL | SWI17.LLP 99.79,24.56 99.79,26.55 101.01,27.77 101.01,30.68 SWI17.LCL
  Bottom 0.153: 102.24,43.53 99.79,43.53 SWI16.LLP | 102.24,43.53 109.74,43.53 SWI16.LRLP | v91.07,60.67 99.94,51.79 101.01,51.79 | 101.01,51.79 102.09,51.79 SWI16.MML | 101.01,51.79 101.01,49.96 SWI16.LCL | 99.79,5.44 99.79,7.58 101.01,8.8 101.01,11.71 SWI18.LCL | 99.79,5.44 109.74,5.44 SWI18.LRLP | 99.79,5.44 SWI18.LLP | v43.03,16.91 43.79,16.91 43.95,16.76 44.86,16.76 45.93,17.83 45.93,18.13 53.13,25.33 56.19,25.33 63.68,32.82 v70.26,32.82 | 102.24,24.56 99.79,24.56 SWI17.LLP | 102.24,24.56 109.74,24.56 SWI17.LRLP | 102.24,24.56 102.24,13.7 SWI18.MML | 102.24,43.53 102.24,32.82 SWI17.MML
DFU  (via drill 0.25)
  Top 0.153: v75.92,35.73 76.69,34.96 80.05,34.96 82.66,37.57 89.54,37.57 v89.85,37.26 | v88.47,64.03 87.25,65.26 87.25,68.62 U1.8
  Top 0.178: SW2.A3 SW2.A4 76.59,34.87 76.69,34.96
  Bottom 0.153: v75.92,35.73 75.92,34.96 SW2.A3 | v89.85,37.26 92.6,40.01 92.6,55.16 88.47,59.29 v88.47,64.03
  Bottom 0.178: SW2.A3 SW2.A4
DMINUS  (via drill 0.35)
  Top 0.178: J1.B7 9.35,73.84 10.01,73.18 10.64,73.18 11.36,72.46 11.36,71.75 | J1.A7 8.08,72.28 v8.08,71.75 | 11.36,71.75 11.36,71.52 11.03,71.19 10.56,71.19 10.41,71.33 v10.08,71.33 | 11.36,71.75 12.79,71.75 12.88,71.66 13.54,71.66 13.63,71.75 v17.15,71.75 | v26.67,73.03 39.37,73.03 v41.91,70.48 | v78.74,73.66 76.84,71.75 62.87,71.75 v62.84,71.78 | U4.5 74.02,78.38 73.91,78.5 73.64,78.5 v73.37,78.78
  Bottom 0.178: v10.08,71.33 9.46,71.95 9.46,71.99 9.06,72.39 8.72,72.39 v8.08,71.75 | v17.15,71.75 25.4,71.75 v26.67,73.03 | v41.91,70.48 42.55,70.48 43.21,69.82 45.41,69.82 48.84,73.26 48.84,74.8 49.62,75.58 50.71,75.58 55.05,71.24 62.3,71.24 v62.84,71.78 | v78.74,73.66 77.97,74.43 77.97,77.26 77.67,77.56 74.59,77.56 v73.37,78.78
DPLUS  (via drill 0.25, 0.35)
  Top 0.153: 9.37,72.6 J1.A6 9.37,72.45 | v77.45,77.04 77.3,77.19 77.3,77.81 75.92,79.18 75,79.18 74.7,78.88 74.7,78.42 U4.4
  Top 0.178: 9.37,72.6 9.37,73.11 9.18,73.3 8.89,73.3 8.75,73.44 8.75,73.73 J1.B6 | J1.A6 8.89,72.09 v8.89,71.75
  Bottom 0.153: v77.45,77.04 74.09,77.04 72.4,78.72 21.15,78.72 13.5,71.07
  Bottom 0.178: v8.89,71.75 9.51,71.14 9.51,71.09 9.84,70.76 13.19,70.76 13.5,71.07
GND  (via drill 0.25, 0.35)
  Top 0.153: U4.3 75.16,78.26 75.16,77.81 75,77.65 75,76.89 U4.21 74.85,76.73 74.85,76.43 74.24,75.82 74.24,75.36 U4.12 | 89.39,78.61 89.39,78.57 U1.39 89.39,78.72
  Top 0.178: 14.51,74.29 J1.SHELLL 12.8,72.59 J1.A1 | 14.51,74.29 14.61,74.29 | R6.1 46.9,78.74 | 46.9,78.74 46.25,78.74 | J1.A1 11.99,72.69 J1.B12 | J1.B1 5.79,72.69 J1.A12 5.48,73 J1.SHELLR 4.18,73.39 4.18,73.65 3.24,74.59 J1.BLADERF 1.11,76.63 1.11,75.18 1.91,74.39 R1.1 | 14.51,74.29 14.54,74.33 J1.BLADELB | J1.BLADELF 14.98,78.32 R4.1 17.36,78.32 v17.78,78.74 | C1.2 79.8,77.41 U1.27 80.99,77.15 81.43,77.15 81.91,76.67 v81.91,76.2 | J1.A1 12.39,72.09 | J1.A1 14.41,72.59 14.91,72.09 | v22.23,78.1 22.23,77.54 22.31,77.46 23.13,77.46 23.27,77.31 23.27,76.43 23.7,76 23.77,76 U3.GND | U1.1 92.71,68.48 v92.71,66.68 | 89.39,78.57 v89.39,76.84 v89.38,76.84 | U1.16 81.18,68.01 v80.65,67.48 | C4.2 44.11,78.74 44.91,79.53 46.1,79.53 46.9,78.74
  Bottom 0.178: v92.71,66.68 90.08,69.3 89.72,69.3 88.54,70.48 v88.26,70.48
  other vias: 15.24,71.12 15.88,72.39 20.32,72.39 59.05,17.78 63.5,17.78 78.1,38.1 77.47,33.65 48.26,79.38 67.31,73.66 63.5,74.29 60.96,74.93 74.29,73.03 79.38,72.77 72.77,73.03 75.06,70.99
  pour Bottom: 0,80.01 4.45,80.01 4.45,74.68 13.34,74.68 13.34,80.01 95.25,80.01 95.25,57.15 114.3,57.15 114.3,0 76.2,0 76.2,13.97 0,13.97
  pour Top: 0,80.01 4.45,80.01 4.45,74.68 13.34,74.68 13.34,80.01 95.25,80.01 95.25,57.15 114.3,57.15 114.3,0 76.2,0 76.2,13.97 0,13.97
N$1
  Top 0.153: SWI1.MMR 12.12,66.02 12.12,65.26 13.19,64.19 SWI1.RCL 13.19,64.03 13.19,59.29 9.67,55.77 SWI1.RLMID 9.67,55.62 10.59,54.7 10.59,52.1 DS1.ANOST 10.75,52.1 14.57,52.1 DS1.ANOT
N$2
  Top 0.153: SWI4.MMR 31.25,68.32 31.25,67.71 32.32,66.64 SWI4.RCL 32.32,66.48 32.32,61.89 28.65,58.22 SWI4.RLMID 28.65,58.07 29.56,57.15 29.56,54.7 DS4.ANOST 29.72,54.55 33.54,54.55 DS4.ANOT
N$3
  Top 0.153: SWI7.MMR 50.22,73.06 50.22,72.45 51.29,71.38 SWI7.RCL 51.29,71.23 51.29,66.48 47.77,62.96 SWI7.RLMID 47.77,62.81 48.69,61.89 48.69,59.14 DS7.ANOST 48.84,59.14 52.67,59.14 DS7.ANOT
N$4
  Top 0.153: SWI10.MMR 69.34,68.32 69.34,67.71 70.41,66.64 SWI10.RCL 70.41,66.48 70.41,61.89 66.74,58.22 SWI10.RLMID 66.74,58.07 67.66,57.15 67.66,54.7 DS10.ANOST 67.81,54.55 71.64,54.55 DS10.ANOT
N$5
  Top 0.153: SWI13.MMR 88.32,54.09 88.32,53.32 89.39,52.25 SWI13.RCL 89.39,52.1 89.39,47.36 85.87,43.84 SWI13.RLMID 85.87,43.69 86.79,42.77 86.79,40.01 DS13.ANOST 86.94,40.01 90.76,40.01 DS13.ANOT
N$6
  Top 0.153: SWI16.MMR 107.44,51.64 107.44,51.03 108.51,49.96 SWI16.RCL 108.51,49.81 108.51,45.22 104.84,41.54 SWI16.RLMID 104.84,41.39 105.76,40.47 105.76,37.57 DS16.ANOST 105.91,37.41 109.74,37.41 DS16.ANOT
N$7
  Top 0.153: SWI2.MMR 12.12,46.9 12.12,46.29 13.19,45.22 SWI2.RCL 13.19,45.06 13.19,40.17 9.67,36.65 SWI2.RLMID 9.67,36.49 10.59,35.58 10.59,33.13 DS2.ANOST 10.75,32.98 14.57,32.98 DS2.ANOT
N$8
  Top 0.153: SWI5.MMR 31.25,49.35 31.25,48.58 32.32,47.51 SWI5.RCL 32.32,47.36 32.32,42.77 28.65,39.1 SWI5.RLMID 28.65,38.94 29.56,38.02 29.56,35.58 DS5.ANOST 29.72,35.58 33.54,35.58 DS5.ANOT
N$9
  Top 0.153: SWI8.MMR 50.22,54.09 50.22,53.32 51.29,52.25 SWI8.RCL 51.29,52.1 51.29,47.36 47.77,43.84 SWI8.RLMID 47.77,43.69 48.69,42.77 48.69,40.01 DS8.ANOST 48.84,40.01 52.67,40.01 DS8.ANOT
N$10
  Top 0.153: SWI11.MMR 69.34,49.35 69.34,48.58 70.41,47.51 SWI11.RCL 70.41,47.36 70.41,42.77 66.74,39.1 SWI11.RLMID 66.74,38.94 67.66,38.02 67.66,35.58 DS11.ANOST 67.81,35.58 71.64,35.58 DS11.ANOT
N$11
  Top 0.153: SWI14.MMR 88.32,34.96 88.32,34.35 89.39,33.28 SWI14.RCL 89.39,33.13 89.39,28.39 85.87,24.87 SWI14.RLMID 85.87,24.71 86.79,23.8 86.79,21.04 DS14.ANOST 86.94,20.89 90.76,20.89 DS14.ANOT
N$12
  Top 0.153: SWI17.MMR 107.44,32.67 107.44,31.9 108.51,30.83 SWI17.RCL 108.51,30.68 108.51,26.09 104.84,22.42 SWI17.RLMID 104.84,22.27 105.76,21.35 105.76,19.05 DS17.ANOST 105.91,19.05 109.74,19.05 DS17.ANOT
N$13
  Top 0.153: DS3.ANOT 19.16,30.37 19.16,26.55 DS3.ANOST 19.01,26.4 13.65,26.4 13.35,26.09 SWI3.RCL | SWI3.MMR 12.12,27.93 12.12,27.16 13.19,26.09 SWI3.RCL | SWI3.RLMID 9.67,17.68 9.67,20.28 13.19,23.8 13.19,25.94 SWI3.RCL
N$14
  Top 0.153: SWI6.MMR 31.25,30.22 31.25,29.61 32.32,28.54 SWI6.RCL 32.32,28.39 32.32,23.8 28.65,20.12 SWI6.RLMID 28.65,19.97 29.56,19.05 29.56,16.6 DS6.ANOST 29.72,16.45 33.54,16.45 DS6.ANOT
N$15
  Top 0.153: SWI9.MMR 50.22,34.96 50.22,34.35 51.29,33.28 SWI9.RCL 51.29,33.13 51.29,28.39 47.77,24.87 SWI9.RLMID 47.77,24.71 48.69,23.8 48.69,21.65 DS9.ANOST 48.84,21.65 52.67,21.65 DS9.ANOT
N$16
  Top 0.153: SWI12.MMR 69.34,30.22 69.34,29.61 70.41,28.54 SWI12.RCL 70.41,28.39 70.41,23.8 66.74,20.12 SWI12.RLMID 66.74,19.97 67.66,19.05 67.66,16.6 DS12.ANOST 67.81,16.45 71.64,16.45 DS12.ANOT
N$17
  Top 0.153: SWI15.MMR 88.32,15.99 88.32,15.23 89.39,14.16 SWI15.RCL 89.39,14 89.39,9.26 85.87,5.74 SWI15.RLMID 85.87,5.59 87.4,4.06 87.4,2.68 DS15.ANOST 87.55,2.53 91.38,2.53 DS15.ANOT
N$18
  Top 0.153: SWI18.MMR 107.44,13.54 107.44,12.93 108.51,11.86 SWI18.RCL 108.51,11.71 108.51,9.41 103.62,4.52 | DS18.ANOT 95.35,15.23 95.35,11.4 DS18.ANOST 95.35,11.25 99.64,6.97 101.17,6.97 103.62,4.52 | 103.62,4.52 104.69,3.45 SWI18.RLMID
N$19
  Top 0.153: U3.CTRL 24.21,74.75 24.52,74.75 25.59,75.82 25.59,77.96 R7.2
N$20
  Top 0.153: J1.B5 | 9.83,72.45 J1.A5 | 4.93,71.07 3.86,72.14 3.86,73.52 2.02,75.36 2.02,75.66 R1.2
  Top 0.178: 5.37,71.07 4.93,71.07 | J1.B5 8.03,73.73 8.03,73.44 7.77,73.18 7.14,73.18 7,73.04 7,72.7 5.37,71.07 | J1.A5 9.78,72.48 9.78,71.84 9.01,71.07 5.37,71.07
N$21
  Top 0.153: U3.VIN 24.06,76.58 24.06,77.96 R7.1 24.06,78.11 24.97,79.03 32.62,79.03 34.15,77.5 SW3.COMM
N$22
  Top 0.153: LED1.C 51.6,78.72 53.74,78.72 R2.1
N$23
  Top 0.153: R2.2 55.57,78.72 57.87,76.43 60.01,76.43 60.47,75.97 60.93,75.97 U2.1
N$24
  Top 0.153: R3.2 58.33,74.44 58.33,75.82 U2.5
N$25
  Top 0.153: 71.79,77.19 73.32,77.19 U4.8 | 71.79,77.19 71.79,75.82 R10.2 | 71.79,77.19 R9.1
N$26
  Top 0.153: U4.9 73.32,76.58 72.86,76.58 72.56,76.28 72.56,75.2 72.25,74.9 71.18,74.9 69.96,76.12 69.96,76.58 69.34,77.19 R8.2
N$27
  Top 0.153: D1.C 20.23,74.44 20.54,74.75 20.54,76.28 T1.E 20.69,76.43 22.22,76.43 C3.1 22.37,76.43 23.29,75.51 23.29,74.44 23.75,73.98 24.67,73.98 26.2,75.51 29.41,75.51 31.25,77.35 31.71,77.35 SW3.1
RESET  (via drill 0.25)
  Top 0.153: v75.92,42.16 75.92,41.39 SW1.A4 | v86.94,72.6 86.94,70.77 87.86,69.85 87.86,68.78 U1.7
  Top 0.178: SW1.A4 SW1.A3
  Bottom 0.153: SW1.A3 76.69,41.39 v75.92,42.16 75.92,49.5 75.31,50.11 75.31,64.95 82.96,72.6 v86.94,72.6
  Bottom 0.178: SW1.A3 SW1.A4 75.92,41.43 v75.92,42.16
ROW1
  Top 0.153: DS16.CATST 103.62,37.41 99.79,37.41 DS16.CATT 99.64,37.57 97.95,39.25 | 97.95,39.25 97.95,47.97 91.68,54.24 91.68,68.62 U1.2 | 97.95,39.25 97.34,38.64 87.09,38.64 85.87,39.86 84.64,39.86 DS13.CATST 84.49,40.01 80.67,40.01 DS13.CATT 80.51,40.01 80.51,41.09 67.66,53.94 66.28,53.94 65.67,54.55 DS10.CATST 65.52,54.55 61.69,54.55 DS10.CATT 61.54,54.7 59.71,56.54 50.07,56.54 47.62,58.99 46.55,58.99 DS7.CATST | DS1.CATST 8.3,52.1 4.47,52.1 DS1.CATT | DS4.CATT 23.6,54.55 27.42,54.55 DS4.CATST 27.57,54.55 28.8,53.32 34.15,53.32 39.82,58.99 42.42,58.99 DS7.CATT
  Bottom 0.153: DS1.CATT 4.47,52.1 12.73,52.1 15.18,54.55 23.44,54.55 DS4.CATT | DS10.CATT 61.54,54.7 52.67,54.7 48.38,58.99 42.57,58.99 DS7.CATT
ROW2  (via drill 0.25)
  Top 0.153: DS14.CATT 80.67,20.89 84.49,20.89 DS14.CATST 84.64,20.89 85.72,20.89 87.55,19.05 99.64,19.05 DS17.CATT 99.79,19.05 103.62,19.05 DS17.CATST | DS2.CATST 8.45,32.98 9.52,32.98 10.75,31.75 19.77,31.75 23.44,35.42 DS5.CATT | DS5.CATST 27.57,35.42 28.65,35.42 29.56,34.51 32.93,34.51 33.24,34.2 36.76,34.2 42.42,39.86 DS8.CATT 42.57,40.01 46.39,40.01 DS8.CATST 46.55,39.86 47.77,39.86 50.07,37.57 59.55,37.57 61.54,35.58 DS11.CATT 61.54,35.42 61.39,35.27 61.39,27.77 62.31,26.86 63.68,26.86 65.52,28.69 65.52,35.42 DS11.CATST | v88.62,77.5 88.62,78.42 U1.38
  Bottom 0.153: DS2.CATT 4.47,33.13 12.89,33.13 15.18,35.42 23.44,35.42 DS5.CATT 23.6,35.58 31.86,35.58 36.14,39.86 42.42,39.86 DS8.CATT | v88.62,77.5 87.4,77.5 73.47,63.58 73.47,58.22 65.52,50.26 65.52,47.2 62.61,44.3 62.61,44.15 60.16,41.7 60.16,36.95 61.54,35.58 DS11.CATT 61.69,35.42 68.43,35.42 80.51,23.34 80.51,21.04 DS14.CATT
ROW3  (via drill 0.25)
  Top 0.153: DS3.CATST 19.16,24.26 19.16,20.43 DS3.CATT 19.16,20.28 19.77,20.28 23.44,16.6 DS6.CATT 23.6,16.45 27.42,16.45 DS6.CATST | 53.74,18.9 59.25,18.9 61.54,16.6 DS12.CATT 61.69,16.45 65.52,16.45 DS12.CATST 65.67,16.45 66.74,16.45 68.73,14.46 76.38,14.46 78.83,12.02 78.83,5.13 81.28,2.68 DS15.CATT 81.43,2.53 85.1,2.53 DS15.CATST 85.26,2.53 86.33,2.53 87.7,1.15 91.84,1.15 95.2,4.52 95.2,4.98 DS18.CATT 95.35,5.13 95.35,8.95 DS18.CATST | 53.74,18.9 50.22,18.9 47.62,21.5 46.55,21.5 DS9.CATST | 53.74,18.9 53.74,15.99 53.13,15.38 52.21,15.38 51.29,16.3 44.41,16.3 43.33,17.37 43.33,17.83 42.57,18.59 42.57,21.5 DS9.CATT | v87.86,71.38 87.86,78.42 U1.37
  Bottom 0.153: DS6.CATT 23.6,16.6 31.86,16.6 36.76,21.5 42.42,21.5 DS9.CATT | v87.86,71.38 86.48,70 86.48,52.25 89.23,49.5 89.23,37.11 93.98,32.36 93.98,6.35 95.2,5.13 DS18.CATT
ROW5T1  (via drill 0.25)
  Top 0.153: v86.33,71.38 86.33,78.42 U1.35
  Bottom 0.153: v86.33,71.38 86.33,70.31 84.64,68.62 84.64,51.95 83.27,50.57 83.27,40.32 84.64,38.94 84.64,32.98 82.35,30.68 82.35,19.82 77.76,15.23 48.54,15.23 47.46,16.3 45.48,16.3 44.56,15.38 INT1.T1
ROW6T2  (via drill 0.25, 0.35)
  Top 0.153: v87.09,69.85 85.72,71.23 85.72,78.42 U1.34
  Top 0.178: v94.61,17.14 92.71,15.24 v92.71,9.52
  Bottom 0.153: v87.09,69.85 87.09,66.94 90.46,63.58 90.46,57.76 | 91.38,9.26 80.67,9.26 76.69,13.24 76.69,14.16 75.92,14.92 47.31,14.92 47.01,15.23 INT1.T2
  Bottom 0.178: 90.46,57.76 94.61,53.6 v94.61,17.14 | v92.71,9.52 92.45,9.26 91.38,9.26
RX0  (via drill 0.25)
  Top 0.153: v76.38,74.9 76.69,75.2 76.69,75.82 76.53,75.97 U4.17 | v79.29,70.92 80.21,70 80.67,70 U1.17
  Bottom 0.153: J3.5 69.96,76.28 71.79,74.44 73.02,74.44 73.47,74.9 v76.38,74.9 79.29,71.99 v79.29,70.92
SWDCLK  (via drill 0.25)
  Top 0.153: v88.47,64.8 88.62,64.95 88.62,68.62 U1.6 | v78.22,54.55 v87.09,63.42
  Bottom 0.153: v87.09,63.42 v88.47,64.8 | v78.22,54.55 77.15,53.48 J2.2
SWDIO  (via drill 0.25)
  Top 0.153: v89.39,70.61 89.39,68.78 U1.5
  Bottom 0.153: v89.39,70.61 88.01,71.99 83.42,71.99 79.9,68.47 79.9,58.68 77.15,55.93 J2.3
TX0  (via drill 0.25, 0.35)
  Top 0.153: v76.38,74.13 77.3,75.05 77.3,76.28 76.99,76.58 76.53,76.58 U4.18 | 78.98,71.53 79.12,71.53 80.67,71.53 U1.19
  Top 0.178: 79.12,71.53 79.02,71.63 v78.73,71.63
  Bottom 0.153: v76.38,74.13 69.5,74.13 67.35,76.28 J3.4
  Bottom 0.178: v76.38,74.13 76.89,73.62 76.91,73.62 78.73,71.8 v78.73,71.63
V_BATT
  Top 0.153: 62,77.81 63.38,77.81 C2.1 | 62,77.81 61.08,77.81 U2.3 | 62,77.81 62,74.9 60.47,73.37 55.73,73.37 51.75,77.35 40.58,77.35 39.2,78.72 R5.2 39.05,78.88 33.24,78.88 32.78,79.34 20.54,79.34 19.77,78.57 T1.C 18.85,78.57 17.94,77.65 17.94,52.25 25.13,45.06 25.13,36.8 27.73,34.2 30.18,34.2 35.07,29.3 42.26,29.3 44.71,26.86 44.71,22.27 49.76,17.22 52.67,17.22 JP1.1
V_USB  (via drill 0.25, 0.35)
  Top 0.153: R4.2 16.56,76.58 16.56,74.44 D1.A 16.56,74.29 16.51,74.29 16.25,74.29 | 7.38,72.45 J1.A9 | 10.44,72.45 J1.A4 | v18.7,77.65 18.7,76.43 T1.B | U4.7 73.32,77.65 73.02,77.65 71.79,78.88 R9.2 71.64,78.88 v70.87,78.11 | v50.83,77.96 50.07,78.72 LED1.A | v57.26,77.81 58.33,77.81 U2.4 | v14.72,73.06 14.88,72.91
  Top 0.178: J1.B9 10.98,73.84 v10.99,73.86 | J1.A9 6.98,72.19 v6.98,71.75 | v6.98,73.75 7.07,73.84 J1.B4 | J1.A4 10.39,72.16 v10.8,71.75 | v14.72,73.06 15.95,74.29 16.51,74.29
  Bottom 0.153: v18.7,77.65 18.7,76.73 14.88,72.91 | 13.5,71.53 13.53,71.56 14.88,72.91 | 57.26,77.96 58.94,77.96 59.09,78.11 63.07,78.11 64.75,76.43 J3.3 64.91,76.43 66.59,78.11 v70.87,78.11 | 57.26,77.96 v50.83,77.96 49.45,76.58 31.25,76.58 24.97,70.31 8.45,70.31 7.07,71.69 v6.98,71.75 | 57.26,77.96 v57.26,77.81 | 14.88,72.91 v14.72,73.06
  Bottom 0.178: v6.98,71.75 6.98,73.66 | 6.98,73.66 v6.98,73.75 | 13.53,71.56 10.99,71.56 v10.8,71.75 10.8,73.66 v10.99,73.86 7.18,73.86 6.98,73.66

### Text on the board
tPlace: +
bPlace: GND | UART HEADER | SWD / 3v3 | GND | +